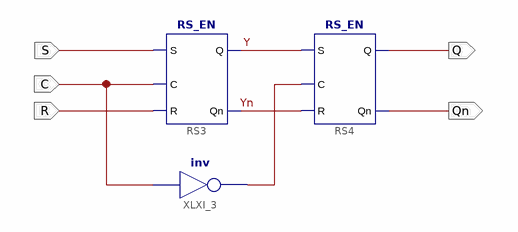
[diagram p0: schematic sheet 1]
// Xilinx ISE schematic RS_Trig.sch (spartan3) as structural Verilog: 3 symbols, 5 ports
module RS_Trig (
  input  S,
  input  R,
  input  C,
  output Q,
  output Qn
);

  wire XLXN_7, Y, Yn;

  RS_EN RS3 (.Q(Y), .Qn(Yn), .C(C), .S(S), .R(R));
  RS_EN RS4 (.Q(Q), .Qn(Qn), .C(XLXN_7), .S(Y), .R(Yn));
  not XLXI_3 (XLXN_7, C);
endmodule
